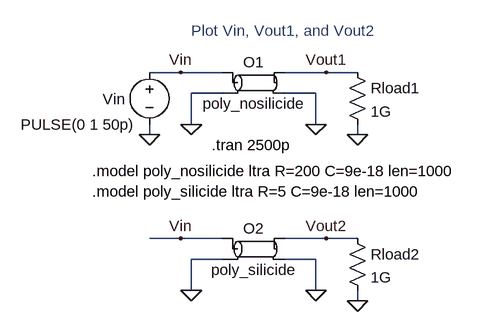
[diagram p0: schematic Fig4_6.asc]
Fig4_6.asc, the LTspice schematic file:
Version 4
SHEET 1 1056 688
WIRE -160 304 -160 288
WIRE -112 208 -160 208
WIRE -112 464 -160 464
WIRE -96 288 -96 240
WIRE -96 544 -96 496
WIRE -48 208 -112 208
WIRE -48 240 -96 240
WIRE -48 464 -112 464
WIRE -48 496 -96 496
WIRE 96 240 48 240
WIRE 96 288 96 240
WIRE 96 496 48 496
WIRE 96 544 96 496
WIRE 112 208 48 208
WIRE 112 464 48 464
WIRE 160 208 112 208
WIRE 160 304 160 288
WIRE 160 464 112 464
WIRE 160 560 160 544
FLAG -160 304 0
FLAG -96 288 0
FLAG 96 288 0
FLAG 160 304 0
FLAG -112 208 Vin
FLAG 112 208 Vout1
FLAG -96 544 0
FLAG 96 544 0
FLAG 160 560 0
FLAG -112 464 Vin
FLAG 112 464 Vout2
SYMBOL ltline 0 224 R0
SYMATTR InstName O1
SYMATTR Value poly_nosilicide
SYMBOL voltage -160 192 R0
WINDOW 0 -72 57 Left 0
WINDOW 3 -198 96 Left 0
WINDOW 123 0 0 Left 0
WINDOW 39 0 0 Left 0
SYMATTR InstName Vin
SYMATTR Value PULSE(0 1 50p)
SYMBOL res 144 192 R0
SYMATTR InstName Rload1
SYMATTR Value 1G
SYMBOL ltline 0 480 R0
SYMATTR InstName O2
SYMATTR Value poly_silicide
SYMBOL res 144 448 R0
SYMATTR InstName Rload2
SYMATTR Value 1G
TEXT -248 360 Left 0 !.model poly_nosilicide ltra R=200 C=9e-18 len=1000\n.model poly_silicide ltra R=5 C=9e-18 len=1000
TEXT -64 320 Left 0 !.tran 2500p
TEXT -96 144 Left 0 ;Plot Vin, Vout1, and Vout2

The netlist it stands for:
* Fig4_6.asc
O1 Vin 0 Vout1 0 poly_nosilicide
Vin Vin 0 PULSE(0 1 50p)
Rload1 Vout1 0 1G
O2 Vin 0 Vout2 0 poly_silicide
Rload2 Vout2 0 1G
.model poly_nosilicide ltra R=200 C=9e-18 len=1000
.model poly_silicide ltra R=5 C=9e-18 len=1000
.tran 2500p
* Plot Vin, Vout1, and Vout2
.backanno
.end